# Altium schematic sheet 3V3_Supply.SchDoc
size 297 x 209 mm; SheetNumber: 7; SheetTotal: 11
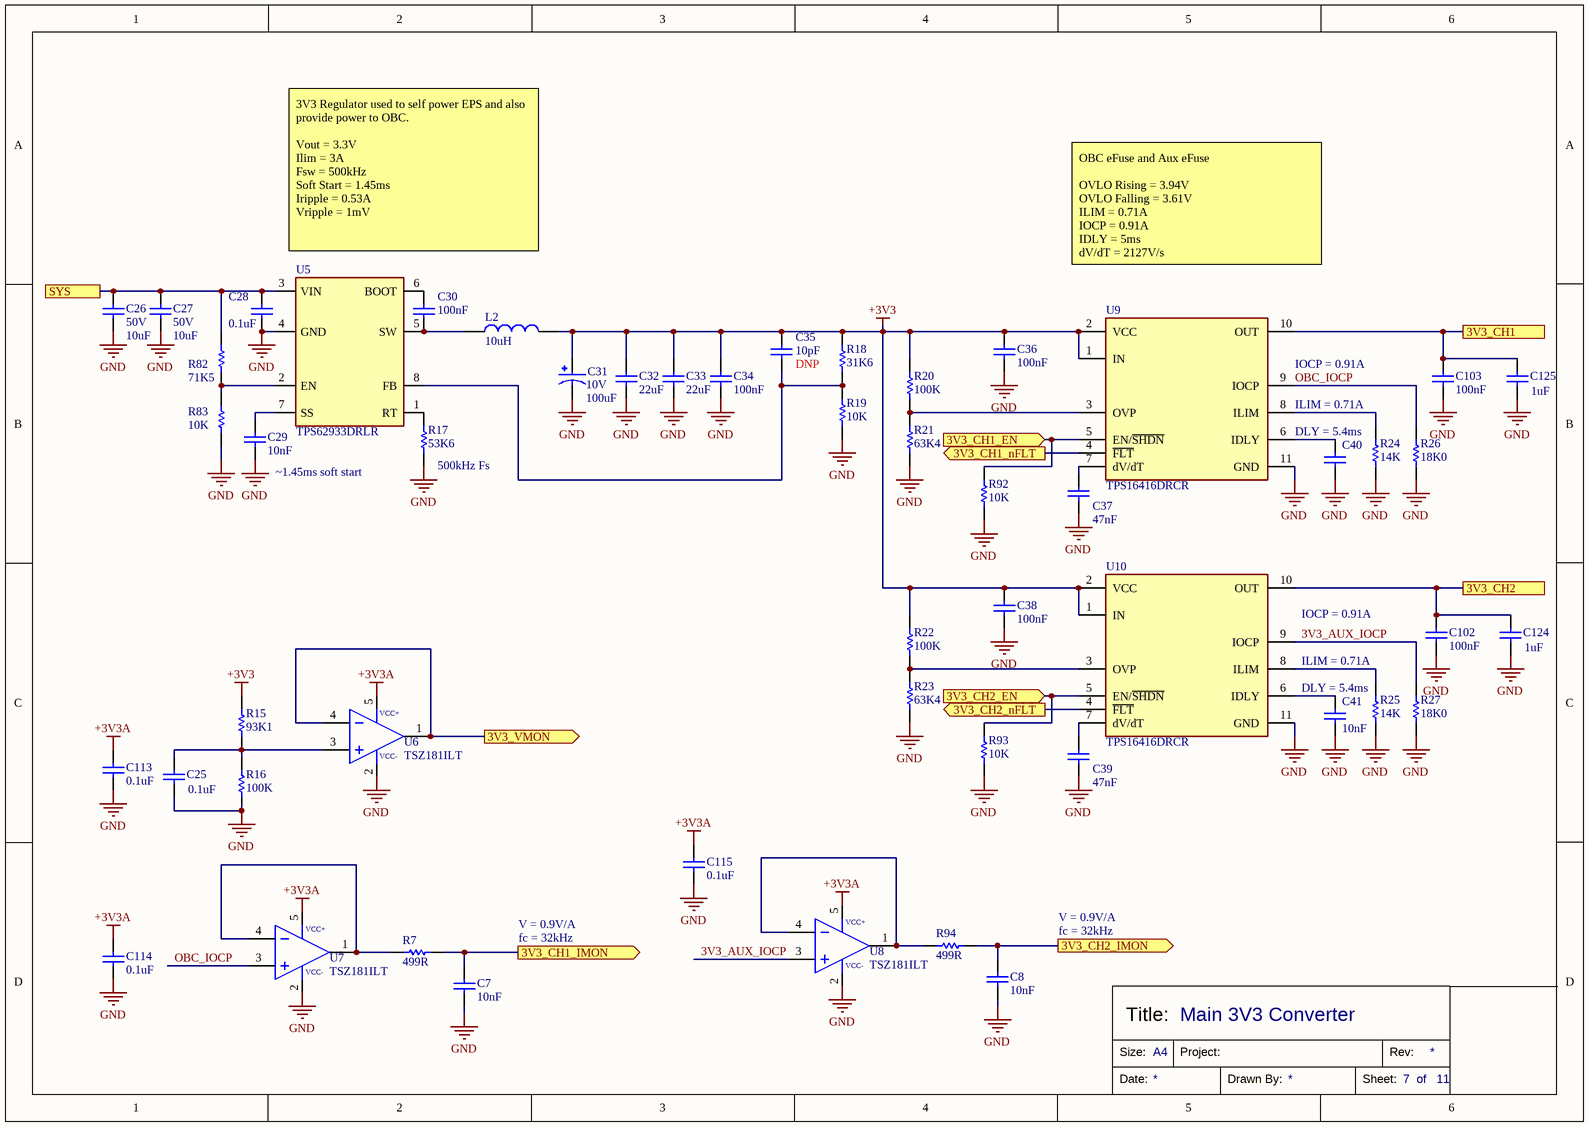
[diagram p0: 3V3_Supply.SchDoc]

## Parts
C7  Capacitance: 10nF  [CAPC0805X060]  (hidden comment: CL21B103KBANNNC)
C8  Capacitance: 10nF  [CAPC0805X060]  (hidden comment: CL21B103KBANNNC)
C25  Capacitance: 0.1uF  [CAPC0805X060]  (hidden comment: CL21B104KACNNNC)
C26  Voltage Rating: 50V  Capacitance: 10uF  [CAPC1210X090]  (hidden comment: CL32B106KBJNNNE)
C27  Voltage Rating: 50V  Capacitance: 10uF  [CAPC1210X090]  (hidden comment: CL32B106KBJNNNE)
C28  Capacitance: 0.1uF  [CAPC0402X020]  (hidden comment: CL05B104KB5NNNC)
C29  Capacitance: 10nF  [CAPC0805X060]  (hidden comment: CL21B103KBANNNC)
C30  Capacitance: 100nF  [CAPC0603X040]  (hidden comment: C0603C104K5RACTU)
C31  Voltage Rating: 10V  Capacitance: 100uF  [2312 Tantalum]  (hidden comment: TPSC107K010R0100)
C32  Capacitance: 22uF  [CAPC0805X060]  (hidden comment: GRM21BZ71A226ME15L)
C33  Capacitance: 22uF  [CAPC0805X060]  (hidden comment: GRM21BZ71A226ME15L)
C34  Capacitance: 100nF  [CAPC0603X040]  (hidden comment: C0603C104K5RACTU)
C35  Capacitance: 10pF  [CAPC0603X040]  (hidden comment: C0603C104K5RACTU)
C36  Capacitance: 100nF  [CAPC0603X040]  (hidden comment: C0603C104K5RACTU)
C37  Capacitance: 47nF  [CAPC0805X060]  (hidden comment: CL21B473KBCNNNC)
C38  Capacitance: 100nF  [CAPC0603X040]  (hidden comment: C0603C104K5RACTU)
C39  Capacitance: 47nF  [CAPC0805X060]  (hidden comment: CL21B473KBCNNNC)
C40  CL21B103KBANNNC  [CAPC0805X060]  (value not drawn)
C41  Capacitance: 10nF  [CAPC0805X060]  (hidden comment: CL21B103KBANNNC)
C102  Capacitance: 100nF  [CAPC0603X040]  (hidden comment: C0603C104K5RACTU)
C103  Capacitance: 100nF  [CAPC0603X040]  (hidden comment: C0603C104K5RACTU)
C113  Capacitance: 0.1uF  [CAPC0603X040]  (hidden comment: C0603C104K5RACTU)
C114  Capacitance: 0.1uF  [CAPC0603X040]  (hidden comment: C0603C104K5RACTU)
C115  Capacitance: 0.1uF  [CAPC0603X040]  (hidden comment: C0603C104K5RACTU)
C124  Capacitance: 1uF  [CAPC0805X060]  (hidden comment: CL21B105KAFNNNE)
C125  Capacitance: 1uF  [CAPC0805X060]  (hidden comment: CL21B105KAFNNNE)
L2  Inductance: 10uH  [1274AS-H-100M=P3]  (hidden comment: 1274AS-H-100M=P3)
R7  Resistance: 499R  [RESC0805]  (hidden comment: RMCF0805FT499R)
R15  Resistance: 93K1  [RESC0603]  (hidden comment: RMCF0603FT93K1)
R16  Resistance: 100K  [RESC0603]  (hidden comment: RMCF0603FT100K)
R17  Resistance: 53K6  [RESC0805]  (hidden comment: RMCF0805FT53K6)
R18  Resistance: 31K6  [RESC0603]  (hidden comment: RMCF0603FT31K6)
R19  Resistance: 10K  [RESC0603]  (hidden comment: RMCF0603FT10K0)
R20  Resistance: 100K  [RESC0805]  (hidden comment: RMCF0805FG100K)
R21  Resistance: 63K4  [RESC0805]  (hidden comment: RMCF0805FT63K4)
R22  Resistance: 100K  [RESC0805]  (hidden comment: RMCF0805FG100K)
R23  Resistance: 63K4  [RESC0805]  (hidden comment: RMCF0805FT63K4)
R24  Resistance: 14K  [RESC0805]  (hidden comment: RMCF0805FT14K0)
R25  Resistance: 14K  [RESC0805]  (hidden comment: RMCF0805FT14K0)
R26  Resistance: 18K0  [RESC0805]  (hidden comment: RMCF0805FT18K0)
R27  Resistance: 18K0  [RESC0805]  (hidden comment: RMCF0805FT18K0)
R82  Resistance: 71K5  [RESC0805]  (hidden comment: RMCF0805FT71K5)
R83  Resistance: 10K  [RESC0603]  (hidden comment: RMCF0603FT10K0)
R92  Resistance: 10K  [RESC0805]  (hidden comment: RMCF0805FT10K0)
R93  Resistance: 10K  [RESC0805]  (hidden comment: RMCF0805FT10K0)
R94  Resistance: 499R  [RESC0805]  (hidden comment: RMCF0805FT499R)
U5  TPS62933DRLR  [SOT-583]
U6  TSZ181ILT  [SOT23-5 IC]
U7  TSZ181ILT  [SOT23-5 IC]
U8  TSZ181ILT  [SOT23-5 IC]
U9  Part Number: TPS16416DRCR  [TPS1641]  (hidden comment: TPS16410DRCR)
U10  Part Number: TPS16416DRCR  [TPS1641]  (hidden comment: TPS16410DRCR)

## Ports
3V3_CH1 (see PDM[6A], PC104[4B], PC104[5B]), 3V3_CH1_EN (in, see PDM[5A], Controller[3D]), 3V3_CH1_IMON (out, see PDM[5A], Controller[1B]), 3V3_CH1_nFLT (out, see PDM[5A], Controller[3D]), 3V3_CH2 (see PDM[6A], PC104[4B], PC104[5B]), 3V3_CH2_EN (in, see PDM[5A], Controller[3D]), 3V3_CH2_IMON (out, see PDM[5A], Controller[1B]), 3V3_CH2_nFLT (out, see PDM[5A], Controller[3D]), 3V3_VMON (out, see PDM[5A], Controller[3B]), SYS (see PDM[5A], 5V_Supply[1A], 6V_Supply[1B], 12V_Supply[1A], PC104[4C], PC104[5C])

## Nets
+3V3: C31.1 C32.2 C33.2 C34.2 C35.2 C36.2 C38.2 L2.2 R15.2 R18.2 R20.2 R22.2 U9.1(IN) U9.2(VCC) U10.1(IN) U10.2(VCC)
+3V3A: C113.2 C114.2 C115.2 U6.5(VCC+) U7.5(VCC+) U8.5(VCC+)
GND: C7.1 C8.1 C25.1 C26.1 C27.1 C28.1 C29.1 C31.2 C32.1 C33.1 C34.1 C36.1 C37.1 C38.1 C39.1 C40.1 C41.1 C102.1 C103.1 C113.1 C114.1 C115.1 C124.1 C125.1 R16.1 R17.1 R19.1 R21.1 R23.1 R24.1 R25.1 R26.1 R27.1 R83.1 R92.1 R93.1 U5.4(GND) U6.2(VCC-) U7.2(VCC-) U8.2(VCC-) U9.11(GND) U10.11(GND)
3V3_AUX_IOCP: R27.2 U8.3(IN+) U10.9(IOCP)
3V3_CH1: C103.2 C125.2 U9.10(OUT) ; port 3V3_CH1
3V3_CH1_EN: R92.2 U9.5(EN/~{SHDN}) ; port 3V3_CH1_EN
3V3_CH1_IMON: C7.2 R7.2 ; port 3V3_CH1_IMON
3V3_CH1_nFLT: U9.4(~{FLT}) ; port 3V3_CH1_nFLT
3V3_CH2: C102.2 C124.2 U10.10(OUT) ; port 3V3_CH2
3V3_CH2_EN: R93.2 U10.5(EN/~{SHDN}) ; port 3V3_CH2_EN
3V3_CH2_IMON: C8.2 R94.2 ; port 3V3_CH2_IMON
3V3_CH2_nFLT: U10.4(~{FLT}) ; port 3V3_CH2_nFLT
3V3_VMON: U6.1(OUT) U6.4(IN-) ; port 3V3_VMON
OBC_IOCP: R26.2 U7.3(IN+) U9.9(IOCP)
SYS: C26.2 C27.2 C28.2 R82.2 U5.3(VIN) ; port SYS
NetC25_2: C25.2 R15.1 R16.2 U6.3(IN+)
NetC29_2: C29.2 U5.7(SS)
NetC30_1: C30.1 L2.1 U5.5(SW)
NetC30_2: C30.2 U5.6(BOOT)
NetC35_1: C35.1 R18.1 R19.2 U5.8(FB)
NetC37_2: C37.2 U9.7(dV/dT)
NetC39_2: C39.2 U10.7(dV/dT)
NetC40_2: C40.2 U9.6(IDLY)
NetC41_2: C41.2 U10.6(IDLY)
NetR7_1: R7.1 U7.1(OUT) U7.4(IN-)
NetR17_2: R17.2 U5.1(RT)
NetR20_1: R20.1 R21.2 U9.3(OVP)
NetR22_1: R22.1 R23.2 U10.3(OVP)
NetR24_2: R24.2 U9.8(ILIM)
NetR25_2: R25.2 U10.8(ILIM)
NetR82_1: R82.1 R83.2 U5.2(EN)
NetR94_1: R94.1 U8.1(OUT) U8.4(IN-)

## Notes on the sheet
- 3V3 Regulator used to self power EPS and also provide power to OBC.
  Vout = 3.3V
  Ilim = 3A
  Fsw = 500kHz
  Soft Start = 1.45ms
  Iripple = 0.53A
  Vripple = 1mV
- OBC eFuse and Aux eFuse
  OVLO Rising = 3.94V
  OVLO Falling = 3.61V
  ILIM = 0.71A
  IOCP = 0.91A
  IDLY = 5ms
  dV/dT = 2127V/s
- (near C35) DNP
- (near U9) IOCP = 0.91A
- ~1.45ms soft start
- (near R17) 500kHz Fs
- DLY = 5.4ms
- ILIM = 0.71A
- (near U10) IOCP = 0.91A
- V = 0.9V/A
- fc = 32kHz
- Main 3V3 Converter
- Size:
- Title:
- A4
- Project:
- Rev:
- Date:
- Drawn By:
- Sheet:
- of

## Library data of the parts
C7 C8 C29 C40 C41 = CL21B103KBANNNC: 10nF ±10% 50V Ceramic Capacitor X7R 0805 (2012 Metric); Voltage Rating: 25V; Part Number: CL21B103KBANNNC; Distributor Part Number: 1276-1015-1-ND; Tolerance: 10%; Case Code: 0805; Distributor: Digikey
C25 = CL21B104KACNNNC: 0.1uF ±10% 25V Ceramic Capacitor X7R 0805 (2012 Metric); Part Number: CL21B104KACNNNC; Distributor Part Number: 1276-1099-1-ND; Tolerance: 10%; Case Code: 0805; Distributor: Digikey; Voltage Rating: 25V
C26 C27 = CL32B106KBJNNNE: 10 µF ±10% 50V Ceramic Capacitor X7R 1210 (3225 Metric); Manufacturer Part Number: CL32B106KBJNNNE; Distributor Part Number: 1276-3387-1-ND; Tolerance: 10%; Case Code: 1210; Distributor: Digikey
C28 = CL05B104KB5NNNC: 0.1 µF ±10% 50V Ceramic Capacitor X7R 0402 (1005 Metric); Part Number: CL05B104KB5NNNC; Tolerance: 10%; Distributor Part Number: 1276-CL05B104KB5NNNCCT-ND; Case Code: 0402; Distributor: Digikey; Voltage Rating: 50V
C30 C34 C36 C38 C102 C103 C113-C115 = C0603C104K5RACTU: 0.1 µF ±10% 50V Ceramic Capacitor X7R 0603 (1608 Metric); Distributor Part Number: 399-C0603C104K5RACTUCT-ND; Tolerance: 10%; Case Code: 0603; Distributor: Digikey; Voltage Rating: 50V
  C30: Manufacturer Part Number: C0603C104K5RACTU
  C34 C36 C38 C102 C103 C113-C115: Part Number: C0603C104K5RACTU
C31 = TPSC107K010R0100: 100 µF Molded Tantalum Capacitors 10 V 2312 (6032 Metric) 100mOhm; Part Number: TPSC107K010R0100; Distributor: Digikey; Distributor Part Number: 478-1765-1-ND; ESR: 100mOhm; Operating Temperature: -55°C ~ 125°C
C32 C33 = GRM21BZ71A226ME15L: 22 µF ±20% 10V Ceramic Capacitor X7R 0805 (2012 Metric); Tolerance: 10%; Part Number: GRM21BZ71A226ME15L; Distributor Part Number: 490-GRM21BZ71A226ME15LCT-ND; Case Code: 0805; Distributor: Digikey; Voltage Rating: 10V
C35 = C0603C100J5GACTU: 10 pF ±5% 50V Ceramic Capacitor C0G, NP0 0603 (1608 Metric); Tolerance: 10%; Part Number: C0603C100J5GACTU; Distributor Part Number: 399-C0603C100J5GACTUCT-ND; Case Code: 0603; Distributor: Digikey; Voltage Rating: 50V
C37 C39 = CL21B473KBCNNNC: 0.047 µF ±10% 50V Ceramic Capacitor X7R 0805 (2012 Metric); Voltage Rating: 25V; Part Number: CL21B473KBCNNNC; Distributor Part Number: 1276-1250-1-ND; Tolerance: 10%; Case Code: 0805; Distributor: Digikey
C124 C125 = CL21B105KAFNNNE: 1uF ±10% 25V Ceramic Capacitor X7R 0805 (2012 Metric); Part Number: CL21B105KAFNNNE; Distributor Part Number: 1276-1066-1-ND; Tolerance: 10%; Case Code: 0805; Distributor: Digikey; Voltage Rating: 25V
L2 = 1274AS-H-100M=P3: Inductor 10 µH , 4.4 A 30.4mOhm Max Shielded Drum Core; Current Rating: 4.4A; Saturation Current: 6.2A; Part Number: 1274AS-H-100M=P3; Distributor Part Number: 490-10846-1-ND; Distributor: Digikey; DCR: 30.4mOhm
R7 R94 = RMCF0805FT499R: 499 Ohms ±1% 0.125W, 1/8W Chip Resistor 0805 (2012 Metric) Automotive AEC-Q200 Thick Film; Part Number: RMCF0805FT499R; Tolerance: 1%; Distributor Part Number: RMCF0805FT499RCT-ND; Distributor: Digikey; Case Code: 0805
R15 = RMCF0603FT93K1: 93.1 kOhms ±1% 0.1W, 1/10W Chip Resistor 0603 (1608 Metric) Automotive AEC-Q200 Thick Film; Part Number: RMCF0603FT93K1; Tolerance: 1%; Distributor: Digikey; Distributor Part Number: RMCF0603FT93K1CT-ND; Case Code: 0603
R16 = RMCF0603FT100K: 100 kOhms ±1% 0.1W, 1/10W Chip Resistor 0603 (1608 Metric) Automotive AEC-Q200 Thick Film; Part Number: RMCF0603FT100K; Tolerance: 1%; Distributor: Digikey; Distributor Part Number: RMCF0603FT100KCT-ND; Case Code: 0603
R17 = RMCF0805FT53K6: 53.6 kOhms ±1% 0.125W, 1/8W Chip Resistor 0805 (2012 Metric) Automotive AEC-Q200 Thick Film; Part Number: RMCF0805FT53K6; Tolerance: 1%; Distributor Part Number: RMCF0805FT53K6CT-ND; Distributor: Digikey; Case Code: 0805
R18 = RMCF0603FT31K6: 31.6 kOhms ±1% 0.1W, 1/10W Chip Resistor 0603 (1608 Metric) Automotive AEC-Q200 Thick Film; Part Number: RMCF0603FT31K6; Tolerance: 1%; Distributor: Digikey; Distributor Part Number: RMCF0603FT31K6CT-ND; Case Code: 0603
R19 R83 = RMCF0603FT10K0: 10 kOhms ±1% 0.1W, 1/10W Chip Resistor 0603 (1608 Metric) Automotive AEC-Q200 Thick Film; Tolerance: 1%; Distributor Part Number: RMCF0603FT10K0CT-ND; Distributor: Digikey; Case Code: 0603; Part Number: RMCF0603FT10K0
R20 R22 = RMCF0805FG100K: 100 kOhms ±1% 0.125W, 1/8W Chip Resistor 0805 (2012 Metric) Automotive AEC-Q200 Thick Film; Part Number: RMCF0805FG100K; Tolerance: 1%; Distributor Part Number: RMCF0805FG100KCT-ND; Distributor: Digikey; Case Code: 0805
R21 R23 = RMCF0805FT63K4: 63.4 kOhms ±1% 0.125W, 1/8W Chip Resistor 0805 (2012 Metric) Automotive AEC-Q200 Thick Film; Part Number: RMCF0805FT63K4; Tolerance: 1%; Distributor Part Number: RMCF0805FT63K4CT-ND; Distributor: Digikey; Case Code: 0805
R24 R25 = RMCF0805FT14K0: 14 kOhms ±1% 0.125W, 1/8W Chip Resistor 0805 (2012 Metric) Automotive AEC-Q200 Thick Film; Part Number: RMCF0805FT14K0; Tolerance: 1%; Distributor Part Number: RMCF0805FT14K0CT-ND; Distributor: Digikey; Case Code: 0805
R26 R27 = RMCF0805FT18K0: 18 kOhms ±1% 0.125W, 1/8W Chip Resistor 0805 (2012 Metric) Automotive AEC-Q200 Thick Film; Part Number: RMCF0805FT18K0; Tolerance: 1%; Distributor Part Number: RMCF0805FT18K0CT-ND; Distributor: Digikey; Case Code: 0805
R82 = RMCF0805FT71K5: 71.5 kOhms ±1% 0.125W, 1/8W Chip Resistor 0805 (2012 Metric) Automotive AEC-Q200 Thick Film; Part Number: RMCF0805FT71K5; Tolerance: 1%; Distributor Part Number: RMCF0805FT71K5CT-ND; Distributor: Digikey; Case Code: 0805
R92 R93 = RMCF0805FT10K0: 10 kOhms ±1% 0.125W, 1/8W Chip Resistor 0805 (2012 Metric) Automotive AEC-Q200 Thick Film; Part Number: RMCF0805FT10K0; Tolerance: 1%; Distributor Part Number: RMCF0805FT10K0CT-ND; Distributor: Digikey; Case Code: 0805
U5 = TPS62933DRLR: Buck Switching Regulator IC Positive Adjustable 0.8V 1 Output 3A SOT-583; Voltage - Input (Min): 3.8V; Voltage - Input (Max): 30V; Voltage - Output (Max): 22V; Part Number: TPS62933DRLR; Distributor Part Number: 296-TPS62933DRLRCT-ND; Distributor: Digikey; Operating Temperature: -40°C ~ 150°C (TJ); Current Output: 3A; Voltage - Output (Min): 0.8V
U6-U8 = TSZ181ILT: Operational Amplifier, General Purpose, 2.2V~5.5V; Voltage Supply (Min): 2.2V; Voltage Supply (Max): 5.5V; Slew Rate: 4.7V/us; Gain Bandwidth Product: 3MHz; Part Number: TSZ181ILT; Distributor: Digikey; Distributor Part Number: 497-18084-1-ND; Operating Temperature: -40°C ~ 125°C
U9 U10 = TPS16410DRCR: 2.7-V to 40-V 152-mΩ 1.8-A eFuse with output power limiting; Qualification: None; Current - Output: 1.8A; Voltage - Input: 2.7V ~ 40V; Distributor Part Number: 296-TPS16410DRCRCT-ND; Package: 10-VSON (3x3); Distributor: Digikey; Operating Temperature: -40C ~ 125C